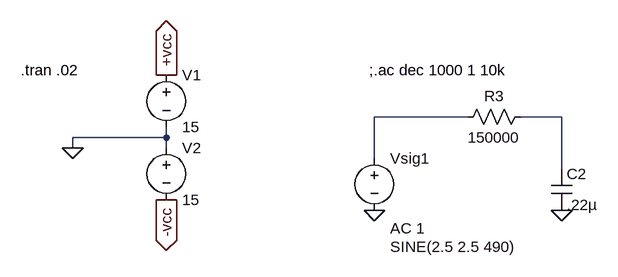
[diagram p0: schematic FILTRO - Passa_Baixa_passivo_freq.asc]
FILTRO - Passa_Baixa_passivo_freq.asc, the LTspice schematic file:
Version 4
SHEET 1 1008 680
WIRE -48 48 -192 48
WIRE 96 48 32 48
WIRE -512 80 -512 64
WIRE -512 80 -656 80
WIRE -656 96 -656 80
WIRE -512 96 -512 80
WIRE -192 112 -192 48
WIRE 96 128 96 48
FLAG -656 96 0
FLAG -512 -16 +vcc
IOPIN -512 -16 Out
FLAG -512 176 -vcc
IOPIN -512 176 Out
FLAG -192 192 0
FLAG 96 192 0
SYMBOL voltage -512 -32 R0
SYMATTR InstName V1
SYMATTR Value 15
SYMBOL voltage -512 80 R0
SYMATTR InstName V2
SYMATTR Value 15
SYMBOL res 48 32 R90
WINDOW 0 0 56 VBottom 2
WINDOW 3 32 56 VTop 2
SYMATTR InstName R3
SYMATTR Value 150000
SYMBOL voltage -192 96 R0
WINDOW 123 24 124 Left 2
WINDOW 39 0 0 Left 0
WINDOW 3 24 152 Left 2
SYMATTR Value2 AC 1
SYMATTR Value SINE(2.5 2.5 490)
SYMATTR InstName Vsig1
SYMBOL cap 80 128 R0
SYMATTR InstName C2
SYMATTR Value .22µ
TEXT -736 -24 Left 2 !.tran .02
TEXT -200 -24 Left 2 !;.ac dec 1000 1 10k

The netlist it stands for:
* FILTRO - Passa_Baixa_passivo_freq.asc
V1 +vcc 0 15
V2 0 -vcc 15
R3 N002 N001 150000
Vsig1 N001 0 SINE(2.5 2.5 490) AC 1
C2 N002 0 .22µ
.tran .02
;.ac dec 1000 1 10k
.backanno
.end